# Altium schematic sheet Surface.SchDoc
size A4
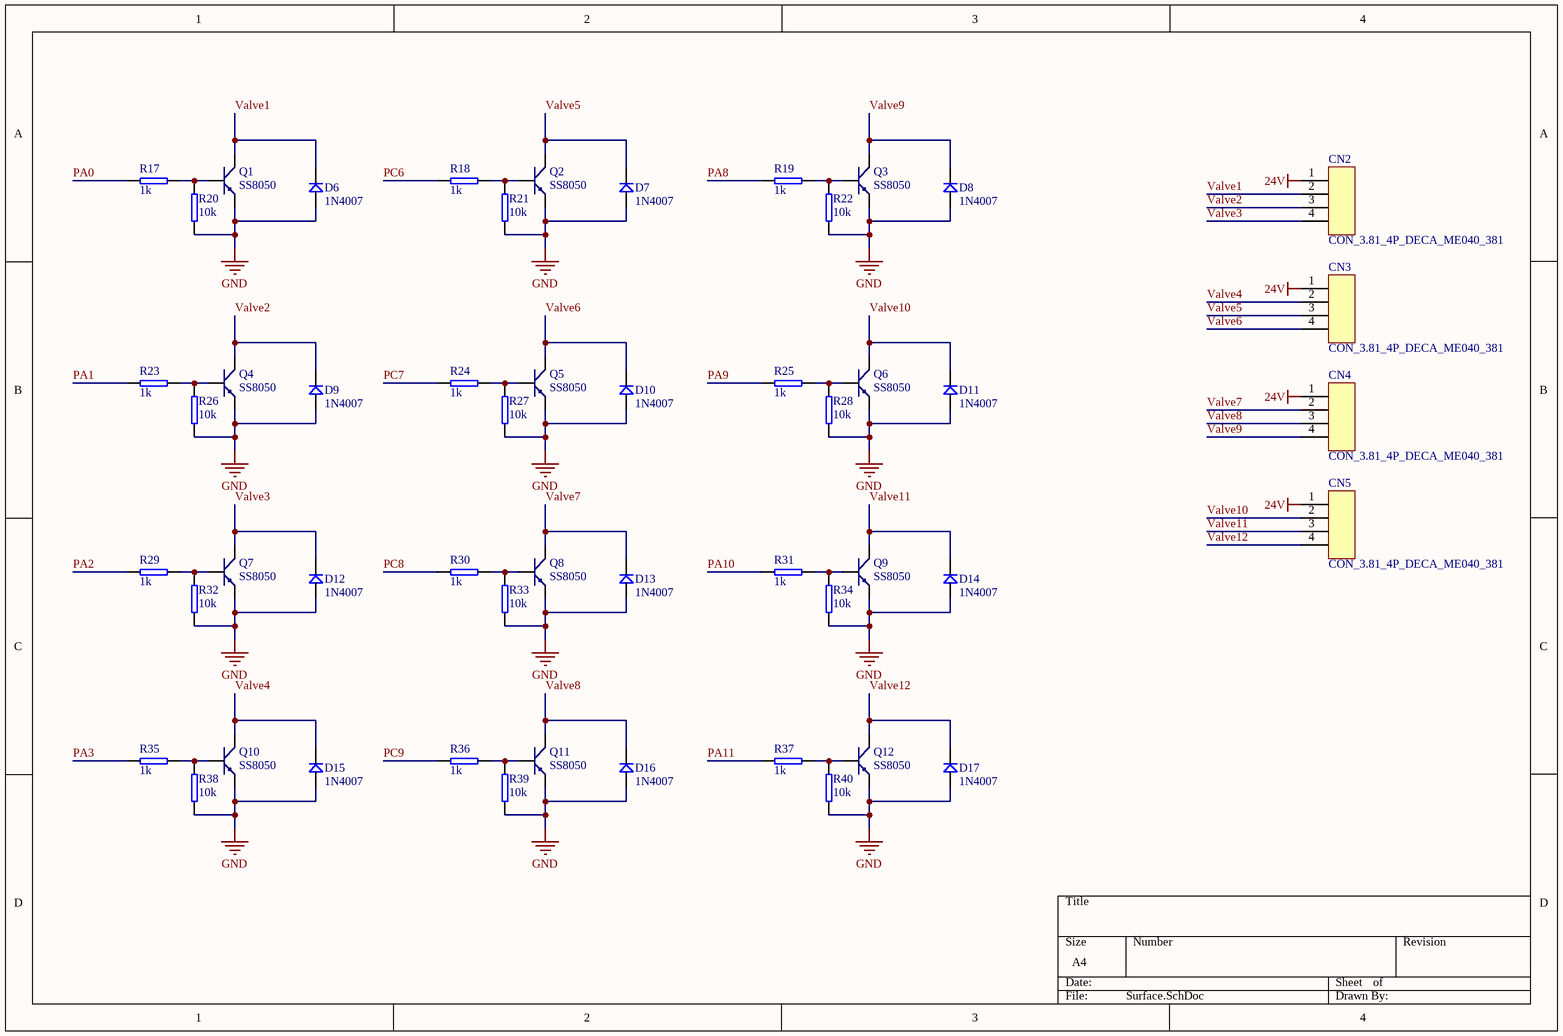
[diagram p0: Surface.SchDoc]

## Parts
CN2  CON_3.81_4P_DECA_ME040_381  [ME040_381_4P_VC-1]
CN3  CON_3.81_4P_DECA_ME040_381  [ME040_381_4P_VC-1]
CN4  CON_3.81_4P_DECA_ME040_381  [ME040_381_4P_VC-1]
CN5  CON_3.81_4P_DECA_ME040_381  [ME040_381_4P_VC-1]
D6  1N4007  [LC-SOD-123]
D7  1N4007  [LC-SOD-123]
D8  1N4007  [LC-SOD-123]
D9  1N4007  [LC-SOD-123]
D10  1N4007  [LC-SOD-123]
D11  1N4007  [LC-SOD-123]
D12  1N4007  [LC-SOD-123]
D13  1N4007  [LC-SOD-123]
D14  1N4007  [LC-SOD-123]
D15  1N4007  [LC-SOD-123]
D16  1N4007  [LC-SOD-123]
D17  1N4007  [LC-SOD-123]
Q1  SS8050  [SOT-23R]
Q2  SS8050  [SOT-23R]
Q3  SS8050  [SOT-23R]
Q4  SS8050  [SOT-23R]
Q5  SS8050  [SOT-23R]
Q6  SS8050  [SOT-23R]
Q7  SS8050  [SOT-23R]
Q8  SS8050  [SOT-23R]
Q9  SS8050  [SOT-23R]
Q10  SS8050  [SOT-23R]
Q11  SS8050  [SOT-23R]
Q12  SS8050  [SOT-23R]
R17  1k  [R0603]
R18  1k  [R0603]
R19  1k  [R0603]
R20  10k  [R0603]
R21  10k  [R0603]
R22  10k  [R0603]
R23  1k  [R0603]
R24  1k  [R0603]
R25  1k  [R0603]
R26  10k  [R0603]
R27  10k  [R0603]
R28  10k  [R0603]
R29  1k  [R0603]
R30  1k  [R0603]
R31  1k  [R0603]
R32  10k  [R0603]
R33  10k  [R0603]
R34  10k  [R0603]
R35  1k  [R0603]
R36  1k  [R0603]
R37  1k  [R0603]
R38  10k  [R0603]
R39  10k  [R0603]
R40  10k  [R0603]

## Nets
24V: CN2.1 CN3.1 CN4.1 CN5.1
GND: D6.1 D7.1 D8.1 D9.1 D10.1 D11.1 D12.1 D13.1 D14.1 D15.1 D16.1 D17.1 Q1.1(E) Q2.1(E) Q3.1(E) Q4.1(E) Q5.1(E) Q6.1(E) Q7.1(E) Q8.1(E) Q9.1(E) Q10.1(E) Q11.1(E) Q12.1(E) R20.2 R21.2 R22.2 R26.2 R27.2 R28.2 R32.2 R33.2 R34.2 R38.2 R39.2 R40.2
PA0: R17.2
PA1: R23.2
PA2: R29.2
PA3: R35.2
PA8: R19.2
PA9: R25.2
PA10: R31.2
PA11: R37.2
PC6: R18.2
PC7: R24.2
PC8: R30.2
PC9: R36.2
Valve1: CN2.2 D6.2 Q1.3(C)
Valve2: CN2.3 D9.2 Q4.3(C)
Valve3: CN2.4 D12.2 Q7.3(C)
Valve4: CN3.2 D15.2 Q10.3(C)
Valve5: CN3.3 D7.2 Q2.3(C)
Valve6: CN3.4 D10.2 Q5.3(C)
Valve7: CN4.2 D13.2 Q8.3(C)
Valve8: CN4.3 D16.2 Q11.3(C)
Valve9: CN4.4 D8.2 Q3.3(C)
Valve10: CN5.2 D11.2 Q6.3(C)
Valve11: CN5.3 D14.2 Q9.3(C)
Valve12: CN5.4 D17.2 Q12.3(C)
NetQ1_2: Q1.2(B) R17.1 R20.1
NetQ2_2: Q2.2(B) R18.1 R21.1
NetQ3_2: Q3.2(B) R19.1 R22.1
NetQ4_2: Q4.2(B) R23.1 R26.1
NetQ5_2: Q5.2(B) R24.1 R27.1
NetQ6_2: Q6.2(B) R25.1 R28.1
NetQ7_2: Q7.2(B) R29.1 R32.1
NetQ8_2: Q8.2(B) R30.1 R33.1
NetQ9_2: Q9.2(B) R31.1 R34.1
NetQ10_2: Q10.2(B) R35.1 R38.1
NetQ11_2: Q11.2(B) R36.1 R39.1
NetQ12_2: Q12.2(B) R37.1 R40.1

## Library data of the parts
CN2-CN5 = CON_3.81_4P_DECA_ME040_381: DECA connector,3.81mm,1*4P,180度; PartNumber: ME040-381-4P; Manufacturer: DECA
D6-D17 = D: 1N4148
Q1-Q12 = NPN: 8050/BCW846/BCW847
R17-R40 = R: 标贴电阻